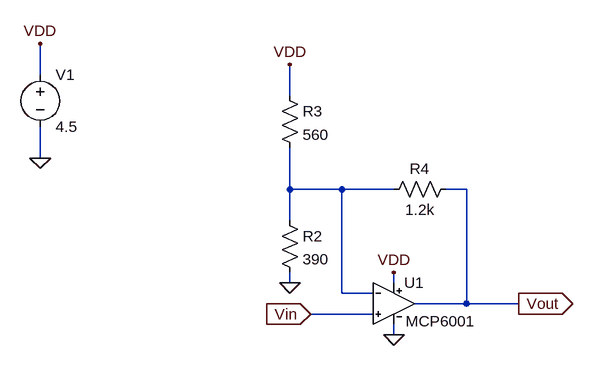
[diagram p0: schematic pos_amp.asc]
pos_amp.asc, the LTspice schematic file:
Version 4
SHEET 1 880 680
WIRE -288 -144 -288 -192
WIRE 96 -112 96 -160
WIRE -288 -16 -288 -64
WIRE 96 32 96 -32
WIRE 176 32 96 32
WIRE 256 32 176 32
WIRE 368 32 336 32
WIRE 96 80 96 32
WIRE 96 176 96 160
WIRE 256 176 256 160
WIRE 176 192 176 32
WIRE 224 192 176 192
WIRE 368 208 368 32
WIRE 368 208 288 208
WIRE 448 208 368 208
WIRE 224 224 128 224
WIRE 256 256 256 240
FLAG 256 256 0
FLAG 256 160 VDD
FLAG 128 224 Vin
IOPIN 128 224 In
FLAG 96 176 0
FLAG 96 -160 VDD
FLAG 448 208 Vout
IOPIN 448 208 Out
FLAG -288 -192 VDD
FLAG -288 -16 0
SYMBOL MCP6001_AB 256 144 R0
SYMATTR InstName U1
SYMBOL res 80 -128 R0
SYMATTR InstName R3
SYMATTR Value 560
SYMBOL res 80 64 R0
SYMATTR InstName R2
SYMATTR Value 390
SYMBOL res 352 16 R90
WINDOW 0 0 56 VBottom 2
WINDOW 3 32 56 VTop 2
SYMATTR InstName R4
SYMATTR Value 1.2k
SYMBOL voltage -288 -160 R0
WINDOW 123 0 0 Left 0
WINDOW 39 0 0 Left 0
SYMATTR InstName V1
SYMATTR Value 4.5

The netlist it stands for:
* pos_amp.asc
XU1 Vin N001 VDD 0 Vout MCP6001  ; pins In+ In- V+ V- OUT
R3 VDD N001 560
R2 N001 0 390
R4 Vout N001 1.2k
V1 VDD 0 4.5
.lib MCP6001.lib
.backanno
.end